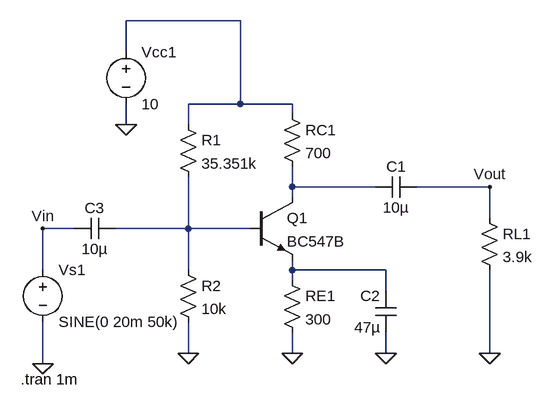
[diagram p0: schematic lab7.1a.asc]
lab7.1a.asc, the LTspice schematic file:
Version 4
SHEET 1 880 680
WIRE -64 -224 -240 -224
WIRE -240 -176 -240 -224
WIRE -64 -96 -64 -224
WIRE -64 -96 -144 -96
WIRE 16 -96 -64 -96
WIRE 16 -80 16 -96
WIRE -240 -64 -240 -96
WIRE -144 -64 -144 -96
WIRE 16 32 16 0
WIRE 144 32 16 32
WIRE 320 32 208 32
WIRE 16 48 16 32
WIRE 320 80 320 32
WIRE -320 96 -368 96
WIRE -144 96 -144 16
WIRE -144 96 -256 96
WIRE -48 96 -144 96
WIRE -368 160 -368 96
WIRE -144 160 -144 96
WIRE 16 160 16 144
WIRE 160 160 16 160
WIRE 16 176 16 160
WIRE 160 192 160 160
WIRE -144 288 -144 240
WIRE 16 288 16 256
WIRE 160 288 160 256
WIRE 320 288 320 160
WIRE -368 304 -368 240
FLAG -368 304 0
FLAG -144 288 0
FLAG 16 288 0
FLAG 160 288 0
FLAG 320 288 0
FLAG -240 -64 0
FLAG 320 32 Vout
FLAG -368 96 Vin
SYMBOL voltage -368 144 R0
WINDOW 123 0 0 Left 0
WINDOW 39 0 0 Left 0
SYMATTR InstName Vs1
SYMATTR Value SINE(0 20m 50k)
SYMBOL res -160 -80 R0
SYMATTR InstName R1
SYMATTR Value 35.351k
SYMBOL res -160 144 R0
SYMATTR InstName R2
SYMATTR Value 10k
SYMBOL res 0 -96 R0
SYMATTR InstName RC1
SYMATTR Value 700
SYMBOL res 0 160 R0
SYMATTR InstName RE1
SYMATTR Value 300
SYMBOL cap 208 16 R90
WINDOW 0 0 32 VBottom 2
WINDOW 3 32 32 VTop 2
SYMATTR InstName C1
SYMATTR Value 10µ
SYMBOL cap 176 256 R180
WINDOW 0 24 56 Left 2
WINDOW 3 24 8 Left 2
SYMATTR InstName C2
SYMATTR Value 47µ
SYMBOL res 304 64 R0
SYMATTR InstName RL1
SYMATTR Value 3.9k
SYMBOL npn -48 48 R0
SYMATTR InstName Q1
SYMATTR Value BC547B
SYMBOL voltage -240 -192 R0
SYMATTR InstName Vcc1
SYMATTR Value 10
SYMBOL cap -256 80 R90
WINDOW 0 0 32 VBottom 2
WINDOW 3 32 32 VTop 2
SYMATTR InstName C3
SYMATTR Value 10µ
TEXT -402 328 Left 2 !.tran 1m

The netlist it stands for:
* lab7.1a.asc
Vs1 Vin 0 SINE(0 20m 50k)
R1 N001 N003 35.351k
R2 N003 0 10k
RC1 N001 N002 700
RE1 N004 0 300
C1 Vout N002 10µ
C2 0 N004 47µ
RL1 Vout 0 3.9k
Q1 N002 N003 N004 0 BC547B
Vcc1 N001 0 10
C3 N003 Vin 10µ
.model NPN NPN
.model PNP PNP
.lib standard.bjt
.tran 1m
.backanno
.end